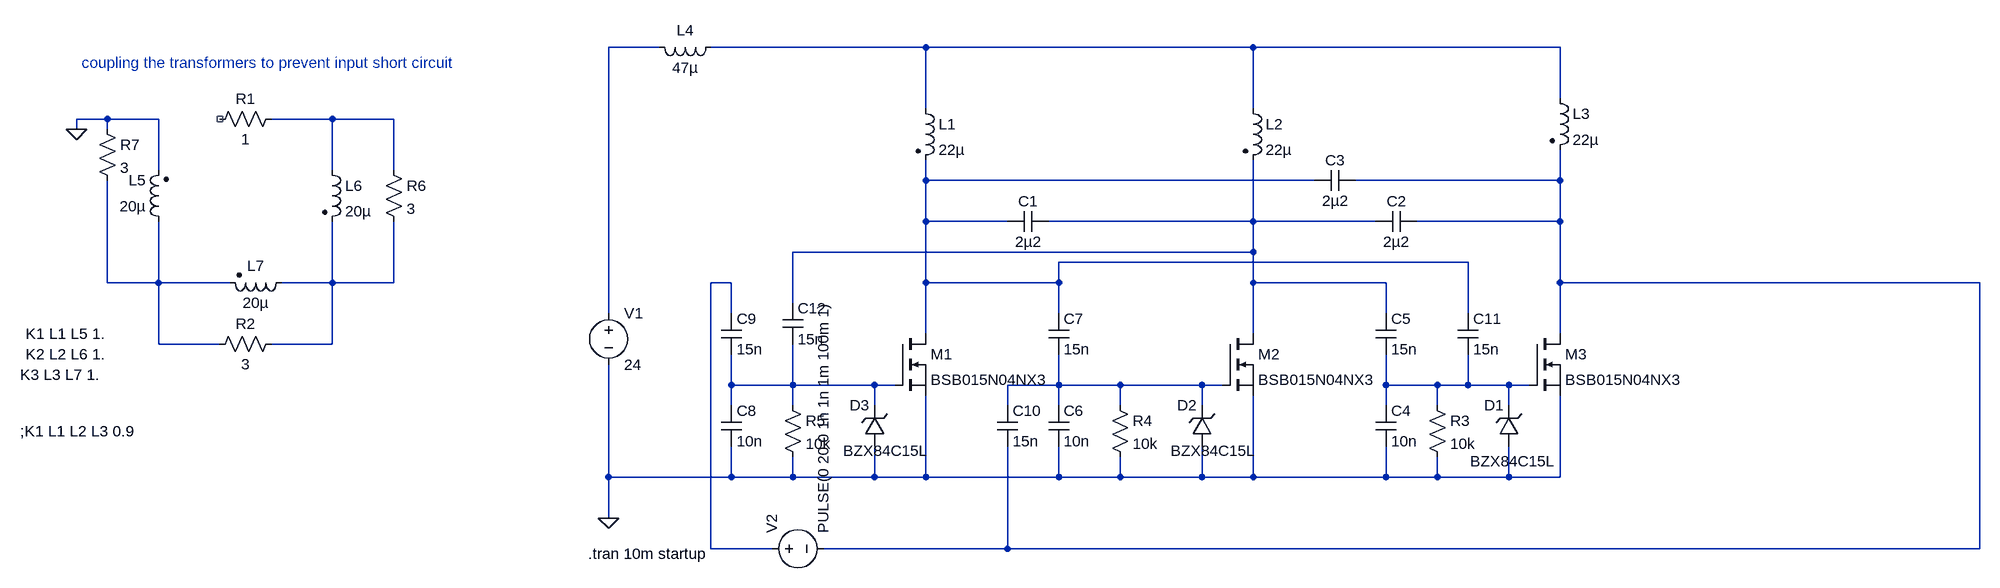
[diagram p0: schematic reso3phasestarcoils2.asc]
reso3phasestarcoils2.asc, the LTspice schematic file:
Version 4
SHEET 1 1924 680
WIRE -160 -448 -240 -448
WIRE 256 -448 -80 -448
WIRE 768 -448 256 -448
WIRE 1248 -448 768 -448
WIRE 1248 -368 1248 -448
WIRE 256 -352 256 -448
WIRE 768 -352 768 -448
WIRE -1024 -336 -1072 -336
WIRE -944 -336 -1024 -336
WIRE -672 -336 -768 -336
WIRE -576 -336 -672 -336
WIRE -1072 -320 -1072 -336
WIRE -1024 -320 -1024 -336
WIRE -944 -256 -944 -336
WIRE -672 -256 -672 -336
WIRE -576 -256 -576 -336
WIRE 256 -240 256 -272
WIRE 864 -240 256 -240
WIRE 1248 -240 1248 -288
WIRE 1248 -240 928 -240
WIRE 256 -176 256 -240
WIRE 384 -176 256 -176
WIRE 768 -176 768 -272
WIRE 768 -176 448 -176
WIRE 960 -176 768 -176
WIRE 1248 -176 1248 -240
WIRE 1248 -176 1024 -176
WIRE 768 -128 768 -176
WIRE 768 -128 48 -128
WIRE 1104 -112 464 -112
WIRE -1024 -80 -1024 -240
WIRE -944 -80 -944 -176
WIRE -944 -80 -1024 -80
WIRE -832 -80 -944 -80
WIRE -672 -80 -672 -176
WIRE -672 -80 -752 -80
WIRE -576 -80 -576 -176
WIRE -576 -80 -672 -80
WIRE -48 -80 -80 -80
WIRE 256 -80 256 -176
WIRE 464 -80 464 -112
WIRE 464 -80 256 -80
WIRE 768 -80 768 -128
WIRE 976 -80 768 -80
WIRE 1248 -80 1248 -176
WIRE 1904 -80 1248 -80
WIRE 48 -48 48 -128
WIRE -240 -32 -240 -448
WIRE -48 -32 -48 -80
WIRE 464 -32 464 -80
WIRE 976 -32 976 -80
WIRE 1104 -32 1104 -112
WIRE 256 0 256 -80
WIRE 768 0 768 -80
WIRE 1248 0 1248 -80
WIRE -944 16 -944 -80
WIRE -848 16 -944 16
WIRE -672 16 -672 -80
WIRE -672 16 -768 16
WIRE -48 80 -48 32
WIRE 48 80 48 16
WIRE 48 80 -48 80
WIRE 176 80 48 80
WIRE 208 80 176 80
WIRE 464 80 464 32
WIRE 464 80 384 80
WIRE 560 80 464 80
WIRE 688 80 560 80
WIRE 720 80 688 80
WIRE 976 80 976 32
WIRE 1056 80 976 80
WIRE 1104 80 1104 32
WIRE 1104 80 1056 80
WIRE 1168 80 1104 80
WIRE 1200 80 1168 80
WIRE -48 112 -48 80
WIRE 48 112 48 80
WIRE 176 112 176 80
WIRE 384 112 384 80
WIRE 464 112 464 80
WIRE 560 112 560 80
WIRE 688 112 688 80
WIRE 976 112 976 80
WIRE 1056 112 1056 80
WIRE 1168 112 1168 80
WIRE -240 224 -240 48
WIRE -48 224 -48 176
WIRE -48 224 -240 224
WIRE 48 224 48 192
WIRE 48 224 -48 224
WIRE 176 224 176 176
WIRE 176 224 48 224
WIRE 256 224 256 96
WIRE 256 224 176 224
WIRE 464 224 464 176
WIRE 464 224 256 224
WIRE 560 224 560 192
WIRE 560 224 464 224
WIRE 688 224 688 176
WIRE 688 224 560 224
WIRE 768 224 768 96
WIRE 768 224 688 224
WIRE 976 224 976 176
WIRE 976 224 768 224
WIRE 1056 224 1056 192
WIRE 1056 224 976 224
WIRE 1168 224 1168 176
WIRE 1168 224 1056 224
WIRE 1248 224 1248 96
WIRE 1248 224 1168 224
WIRE -240 288 -240 224
WIRE -80 336 -80 -80
WIRE 16 336 -80 336
WIRE 384 336 384 176
WIRE 384 336 96 336
WIRE 1904 336 1904 -80
WIRE 1904 336 384 336
FLAG -240 288 0
FLAG -1072 -320 0
SYMBOL voltage -240 -48 R0
WINDOW 123 0 0 Left 2
WINDOW 39 0 0 Left 2
SYMATTR InstName V1
SYMATTR Value 24
SYMBOL nmos 208 0 R0
SYMATTR InstName M1
SYMATTR Value BSB015N04NX3
SYMBOL nmos 720 0 R0
SYMATTR InstName M2
SYMATTR Value BSB015N04NX3
SYMBOL nmos 1200 0 R0
SYMATTR InstName M3
SYMATTR Value BSB015N04NX3
SYMBOL ind2 240 -368 R0
SYMATTR InstName L1
SYMATTR Value 22µ
SYMATTR Type ind
SYMATTR SpiceLine Rser=0.001
SYMBOL ind2 752 -368 R0
SYMATTR InstName L2
SYMATTR Value 22µ
SYMATTR Type ind
SYMBOL ind2 1232 -384 R0
SYMATTR InstName L3
SYMATTR Value 22µ
SYMATTR Type ind
SYMBOL cap 448 -192 R90
WINDOW 0 0 32 VBottom 2
WINDOW 3 32 32 VTop 2
SYMATTR InstName C1
SYMATTR Value 2µ2
SYMBOL cap 1024 -192 R90
WINDOW 0 0 32 VBottom 2
WINDOW 3 32 32 VTop 2
SYMATTR InstName C2
SYMATTR Value 2µ2
SYMBOL cap 928 -256 R90
WINDOW 0 0 32 VBottom 2
WINDOW 3 32 32 VTop 2
SYMATTR InstName C3
SYMATTR Value 2µ2
SYMBOL ind -64 -464 R90
WINDOW 0 5 56 VBottom 2
WINDOW 3 32 56 VTop 2
SYMATTR InstName L4
SYMATTR Value 47µ
SYMBOL ind2 -928 -160 R180
WINDOW 0 36 80 Left 2
WINDOW 3 36 40 Left 2
SYMATTR InstName L5
SYMATTR Value 20µ
SYMATTR Type ind
SYMBOL ind2 -688 -272 R0
SYMATTR InstName L6
SYMATTR Value 20µ
SYMATTR Type ind
SYMBOL ind2 -736 -96 R90
WINDOW 0 5 56 VBottom 2
WINDOW 3 32 56 VTop 2
SYMATTR InstName L7
SYMATTR Value 20µ
SYMATTR Type ind
SYMBOL res -752 -352 R90
WINDOW 0 0 56 VBottom 2
WINDOW 3 32 56 VTop 2
SYMATTR InstName R1
SYMATTR Value 1
SYMBOL res -752 0 R90
WINDOW 0 0 56 VBottom 2
WINDOW 3 32 56 VTop 2
SYMATTR InstName R2
SYMATTR Value 3
SYMBOL zener 1184 176 R180
WINDOW 0 24 64 Left 2
WINDOW 3 -55 -23 Left 2
SYMATTR InstName D1
SYMATTR Value BZX84C15L
SYMATTR Description Diode
SYMATTR Type diode
SYMBOL res 1040 96 R0
SYMATTR InstName R3
SYMATTR Value 10k
SYMBOL cap 960 112 R0
SYMATTR InstName C4
SYMATTR Value 10n
SYMBOL cap 960 -32 R0
SYMATTR InstName C5
SYMATTR Value 15n
SYMBOL zener 704 176 R180
WINDOW 0 24 64 Left 2
WINDOW 3 -66 -7 Left 2
SYMATTR InstName D2
SYMATTR Value BZX84C15L
SYMATTR Description Diode
SYMATTR Type diode
SYMBOL res 544 96 R0
SYMATTR InstName R4
SYMATTR Value 10k
SYMBOL cap 448 112 R0
SYMATTR InstName C6
SYMATTR Value 10n
SYMBOL cap 448 -32 R0
SYMATTR InstName C7
SYMATTR Value 15n
SYMBOL zener 192 176 R180
WINDOW 0 24 64 Left 2
WINDOW 3 -66 -7 Left 2
SYMATTR InstName D3
SYMATTR Value BZX84C15L
SYMATTR Description Diode
SYMATTR Type diode
SYMBOL res 32 96 R0
SYMATTR InstName R5
SYMATTR Value 10k
SYMBOL cap -64 112 R0
SYMATTR InstName C8
SYMATTR Value 10n
SYMBOL cap -64 -32 R0
SYMATTR InstName C9
SYMATTR Value 15n
SYMBOL voltage 0 336 R270
WINDOW 123 0 0 Left 2
WINDOW 39 0 0 Left 2
SYMATTR InstName V2
SYMATTR Value PULSE(0 20 0 1n 1n 1m 100m 1)
SYMBOL res -592 -272 R0
SYMATTR InstName R6
SYMATTR Value 3
SYMBOL res -1040 -336 R0
SYMATTR InstName R7
SYMATTR Value 3
SYMBOL cap 368 112 R0
SYMATTR InstName C10
SYMATTR Value 15n
SYMBOL cap 1088 -32 R0
SYMATTR InstName C11
SYMATTR Value 15n
SYMBOL cap 32 -48 R0
SYMATTR InstName C12
SYMATTR Value 15n
TEXT -272 344 Left 2 !.tran 10m startup
TEXT -1152 0 Left 2 !K1 L1 L5 1.
TEXT -1152 32 Left 2 !K2 L2 L6 1.
TEXT -1160 64 Left 2 !K3 L3 L7 1.
TEXT -1160 152 Left 2 !;K1 L1 L2 L3 0.9
TEXT -1064 -424 Left 2 ;coupling the transformers to prevent input short circuit

The netlist it stands for:
* reso3phasestarcoils2.asc
V1 N001 0 24
M1 N004 N010 0 0 BSB015N04NX3
M2 N006 N011 0 0 BSB015N04NX3
M3 N005 N012 0 0 BSB015N04NX3
L1 N002 N004 22µ Rser=0.001
L2 N002 N006 22µ
L3 N002 N005 22µ
C1 N006 N004 2µ2
C2 N005 N006 2µ2
C3 N005 N004 2µ2
L4 N002 N001 47µ
L5 N007 0 20µ
L6 N003 N008 20µ
L7 N008 N007 20µ
R1 N003 NC_01 1
R2 N008 N007 3
D1 0 N012 BZX84C15L
R3 N012 0 10k
C4 N012 0 10n
C5 N006 N012 15n
D2 0 N011 BZX84C15L
R4 N011 0 10k
C6 N011 0 10n
C7 N004 N011 15n
D3 0 N010 BZX84C15L
R5 N010 0 10k
C8 N010 0 10n
C9 N009 N010 15n
V2 N009 N005 PULSE(0 20 0 1n 1n 1m 100m 1)
R6 N003 N008 3
R7 0 N007 3
C10 N011 N005 15n
C11 N004 N012 15n
C12 N006 N010 15n
.model D D
.lib standard.dio
.model NMOS NMOS
.model PMOS PMOS
.lib standard.mos
.tran 10m startup
K1 L1 L5 1.
K2 L2 L6 1.
K3 L3 L7 1.
;K1 L1 L2 L3 0.9
* coupling the transformers to prevent input short circuit
.backanno
.end